# EAGLE schematic revision_0.3 (EAGLE 6.5.0)
Wave exposure logger by Andrew Davies
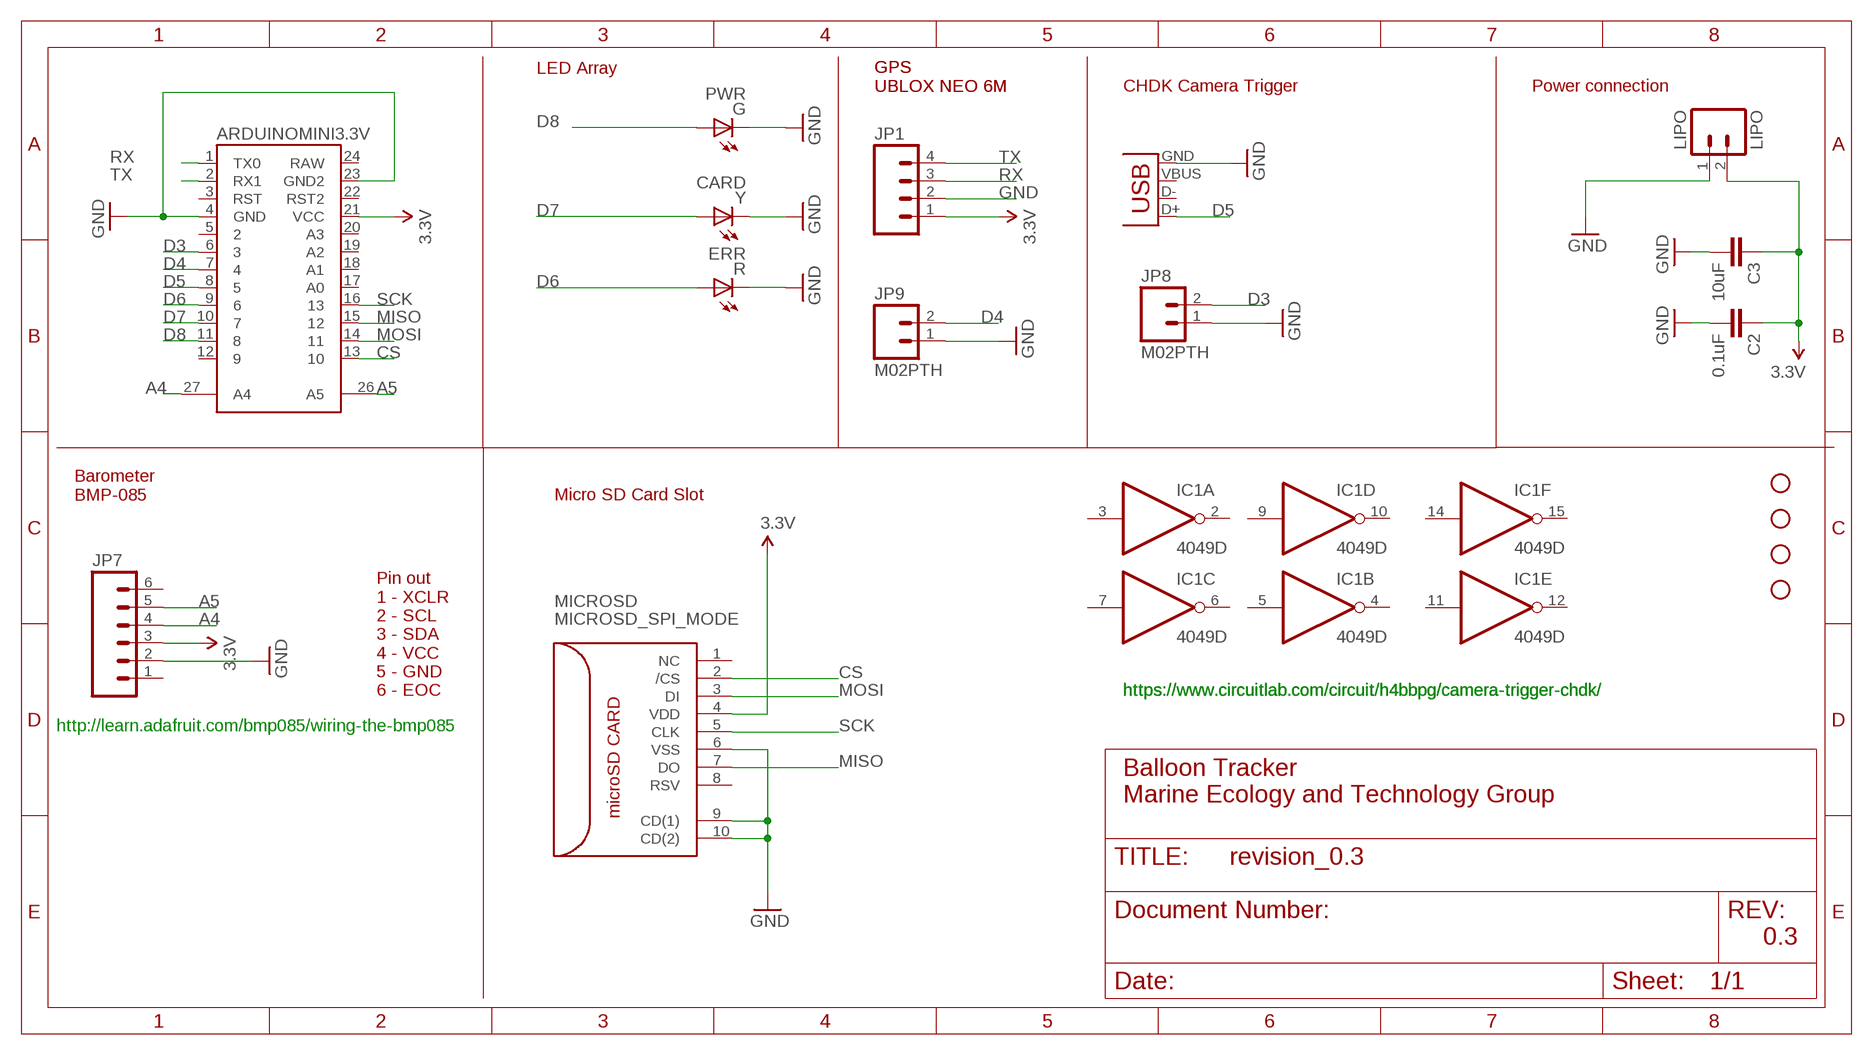
[diagram p0: schematic, sheet 1]

## Parts
ARDUINOMINI3.3V  ARDUINO_MINI  [ARDUINO_MINI]
C2  0.1uF  CAP0805  [0805]
C3  10uF  CAP0805  [0805]
G  PWR  LEDCHIP-LED0805  [CHIP-LED0805]
IC1  4049D  [SO16]
JP1  M04PTH  [1X04]
JP2  USB-A-SMD  [USB-A-S-NOSILK-FEMALE]
JP3  STAND-OFF  [STAND-OFF]
JP4  STAND-OFF  [STAND-OFF]
JP5  STAND-OFF  [STAND-OFF]
JP6  STAND-OFF  [STAND-OFF]
JP7  M06SIP  [1X06]
JP8  M02PTH  [1X02]
JP9  M02PTH  [1X02]
LIPO  LIPO  M02JST-PTH-2  [JST-2-PTH]
MICROSD  MICROSD_SPI_MODE  [MICRO_SD_CONNECTOR]
R  ERR  LEDCHIP-LED0805  [CHIP-LED0805]
Y  CARD  LEDCHIP-LED0805  [CHIP-LED0805]

## Nets
1.0V: JP1.1 JP7.3 ; supply symbol labelled 3.3V
3.3V: ARDUINOMINI3.3V.21(VCC) C2.1 C3.1 LIPO.2 MICROSD.4(VDD)
A4: ARDUINOMINI3.3V.27(A4) JP7.4
A5: ARDUINOMINI3.3V.26(A5) JP7.5
CS: ARDUINOMINI3.3V.13 MICROSD.2(/CS)
D3: ARDUINOMINI3.3V.6 JP8.2
D4: ARDUINOMINI3.3V.7 JP9.2
D5: ARDUINOMINI3.3V.8 JP2.D+
D6: ARDUINOMINI3.3V.9 R.A
D7: ARDUINOMINI3.3V.10 Y.A
D8: ARDUINOMINI3.3V.11 G.A
GND: ARDUINOMINI3.3V.4(GND) ARDUINOMINI3.3V.23(GND2) C2.2 C3.2 G.C JP1.2 JP2.GND JP7.2 JP8.1 JP9.1 LIPO.1 MICROSD.6(VSS) MICROSD.9(CD(1)) MICROSD.10(CD(2)) R.C Y.C
MISO: ARDUINOMINI3.3V.15 MICROSD.7(DO)
MOSI: ARDUINOMINI3.3V.14 MICROSD.3(DI)
RX: ARDUINOMINI3.3V.1(TX0) JP1.3
SCK: ARDUINOMINI3.3V.16 MICROSD.5(CLK)
TX: ARDUINOMINI3.3V.2(RX1) JP1.4
Unconnected: ARDUINOMINI3.3V.3(RST) ARDUINOMINI3.3V.5 ARDUINOMINI3.3V.12 ARDUINOMINI3.3V.17(A0) ARDUINOMINI3.3V.18(A1) ARDUINOMINI3.3V.19(A2) ARDUINOMINI3.3V.20(A3) ARDUINOMINI3.3V.22(RST2) ARDUINOMINI3.3V.24(RAW) IC1.2(A:O) IC1.3(A:I) IC1.4(B:O) IC1.5(B:I) IC1.6(C:O) IC1.7(C:I) IC1.9(D:I) IC1.10(D:O) IC1.11(E:I) IC1.12(E:O) IC1.14(F:I) IC1.15(F:O) JP2.D- JP2.VBUS JP7.1 JP7.6 MICROSD.1(NC) MICROSD.8(RSV)

## Notes on the sheet
- LED Array
- GPS
  UBLOX NEO 6M
- GPS
  UBLOX NEO 6M
- CHDK Camera Trigger | Power connection
- Barometer
  BMP-085
- Micro SD Card Slot
- Pin out
  1 - XCLR
  2 - SCL
  3 - SDA
  4 - VCC
  5 - GND
  6 - EOC
- https://www.circuitlab.com/circuit/h4bbpg/camera-trigger-chdk/ | https://www.circuitlab.com/circuit/h4bbpg/camera-trigger-chdk/
- http://learn.adafruit.com/bmp085/wiring-the-bmp085
- Balloon Tracker
  Marine Ecology and Technology Group
- 0.3

## Power pins joined to a net without a drawn wire
VDD: IC1.1(P:VDD)
VSS: IC1.8(P:VSS)

## Library data of the parts
ARDUINOMINI3.3V = SparkFun:ARDUINO_MINI
C2 C3 = SparkFun:CAP: Capacitor Standard 0603 ceramic capacitor, and 0.1" leaded capacitor.
G R Y = adafruit:LED: LED OSRAM: - CHIPLED LG R971, LG N971, LY N971, LG Q971, LY Q971, LO R971, LY R971 LH N974, LH R974 LS Q976, LO Q976, LY Q976 LO Q996 - Hyper CHIPLED LW Q18S LB Q993, LB Q99A, LB R99A - SideLED LS A670, LO A670, LY A670, LG A670, LP A670 LB A673, LV A673, LT A673, LW A673 LH A674 LY A675 LS A676, LA A676, LO A676, LY A676, LW A676 LS A679, LY A679, LG A679 - Hyper Micro SIDELED® LS Y876, LA Y876, LO Y876, LY Y876 LT Y87S - SmartLED LW L88C, LW L88S LB L89C, LB L89S, LG L890 LS L89K, LO L89K, LY L89K LS L896, LA L896, LO L896, LY L896 - TOPLED LS T670, LO T670, LY T670, LG T670, LP T670 LSG T670, LSP T670, LSY T670, LOP T670, LYG T670 LG T671, LOG T671, LSG T671 LB T673, LV T673, LT T673, LW T673 LH T674 LS T676, LA T676, LO T676, LY T676, LB T676, LH T676, LSB T676, LW T676 LB T67C, LV T67C, LT T67C, LS T67K, LO T67K, LY T67K, LW E67C LS E67B, LA E67B, LO E67B, LY E67B, LB E67C, LV E67C, LT E67C LW T67C LS T679, LY T679, LG T679 LS T770, LO T770, LY T770, LG T770, LP T770 LB T773, LV T773, LT T773, LW T773 LH T774 LS E675, LA E675, LY E675, LS T675 LS T776, LA T776, LO T776, LY T776, LB T776 LHGB T686 LT T68C, LB T68C - Hyper Mini TOPLED® LB M676 - Mini TOPLED Santana® LG M470 LS M47K, LO M47K, LY M47K Source: http://www.osram.convergy.de/
IC1 = 40xx:4049: Hex inverting BUFFER
JP1 = SparkFun-Connectors:M04: Header 4 Standard 4-pin 0.1" header. Use with straight break away headers (SKU : PRT-00116), right angle break away headers (PRT-00553), swiss pins (PRT-00743), machine pins (PRT-00117), and female headers (PRT-00115). Molex polarized connector foot print use with SKU : PRT-08231 with associated crimp pins and housings. 1MM SMD Version SKU: PRT-10208
JP2 = SparkFun-Connectors:USB: USB Connectors USB-B-PTH is fully proven SKU : PRT-00139/CONN-08278 USB-miniB is fully proven SKU : PRT-00587 USB-A-PCB is untested. USB-A-H is throughly reviewed, but untested. Spark Fun Electronics SKU : PRT-00437 USB-B-SMT is throughly reviewed, but untested. Needs silkscreen touching up. USB-A-S has not been used/tested USB-MB-H has not been used/tested USB-MICROB has been used. CONN-09505; PROD_ID: CONN-09520
JP3-JP6 = SparkFun:STAND-OFF: Stand Off This is the mechanical footprint for a #4 phillips button head screw. Use the keepout ring to avoid running the screw head into surrounding components. SKU : PRT-00447
JP7 = SparkFun-Connectors:M06: Header 6 Standard 6-pin 0.1" header. Use with straight break away headers (SKU : PRT-00116), right angle break away headers (PRT-00553), swiss pins (PRT-00743), machine pins (PRT-00117), and female headers (PRT-00115). Molex polarized connector foot print use with SKU : PRT-08094 with associated crimp pins and housings. NOTES ON THE VARIANTS LOCK and LOCK_LONGPADS... This footprint was designed to help hold the alignment of a through-hole component (i.e. 6-pin header) while soldering it into place. You may notice that each hole has been shifted either up or down by 0.005 of an inch from it's more standard position (which is a perfectly straight line). This slight alteration caused the pins (the squares in the middle) to touch the edges of the holes. Because they are alternating, it causes a "brace" to hold the component in place. 0.005 has proven to be the perfect amount of "off-center" position when using our standard breakaway headers. Although looks a little odd when you look at the bare footprint, once you have a header in there, the alteration is very hard to notice. Also,if you push a header all the way into place, it is covered up entirely on the bottom side. This idea of altering the position of holes to aid alignment will be further integrated into the Sparkfun Library for other footprints. It can help hold any component with 3 or more connection pins.
JP8 JP9 = SparkFun-Connectors:M02: Standard 2-pin 0.1" header. Use with - straight break away headers ( PRT-00116) - right angle break away headers (PRT-00553) - swiss pins (PRT-00743) - machine pins (PRT-00117) - female headers (PRT-00115) Molex polarized connector foot print use with: PRT-08233 with associated crimp pins and housings. 2.54_SCREWTERM for use with PRT-10571. 3.5mm Screw Terminal footprints for PRT-08084 5mm Screw Terminal footprints for use with PRT-08433
LIPO = SparkFun:M02: Header 2 Standard 2-pin 0.1" header. Use with straight break away headers (SKU : PRT-00116), right angle break away headers (PRT-00553), swiss pins (PRT-00743), machine pins (PRT-00117), and female headers (PRT-00115). Molex polarized connector foot print use with SKU : PRT-08233 with associated crimp pins and housings.
MICROSD = con-molex-microsd:MICROSD_SPI_MODE: MOLEX - 49225-0821 - CONNECTEUR MICRO SD PUSH/PUSH REV Fabricant: MOLEX Code commande Farnell: 1366700 <http://fr.farnell.com/molex/49225-0821/connecteur-micro-sd-push-push-rev/dp/1366700?Ntt=1366700> Référence fabricant: 49225-0821